# EAGLE design ESL_EMITTER (EAGLE 9.4.2)
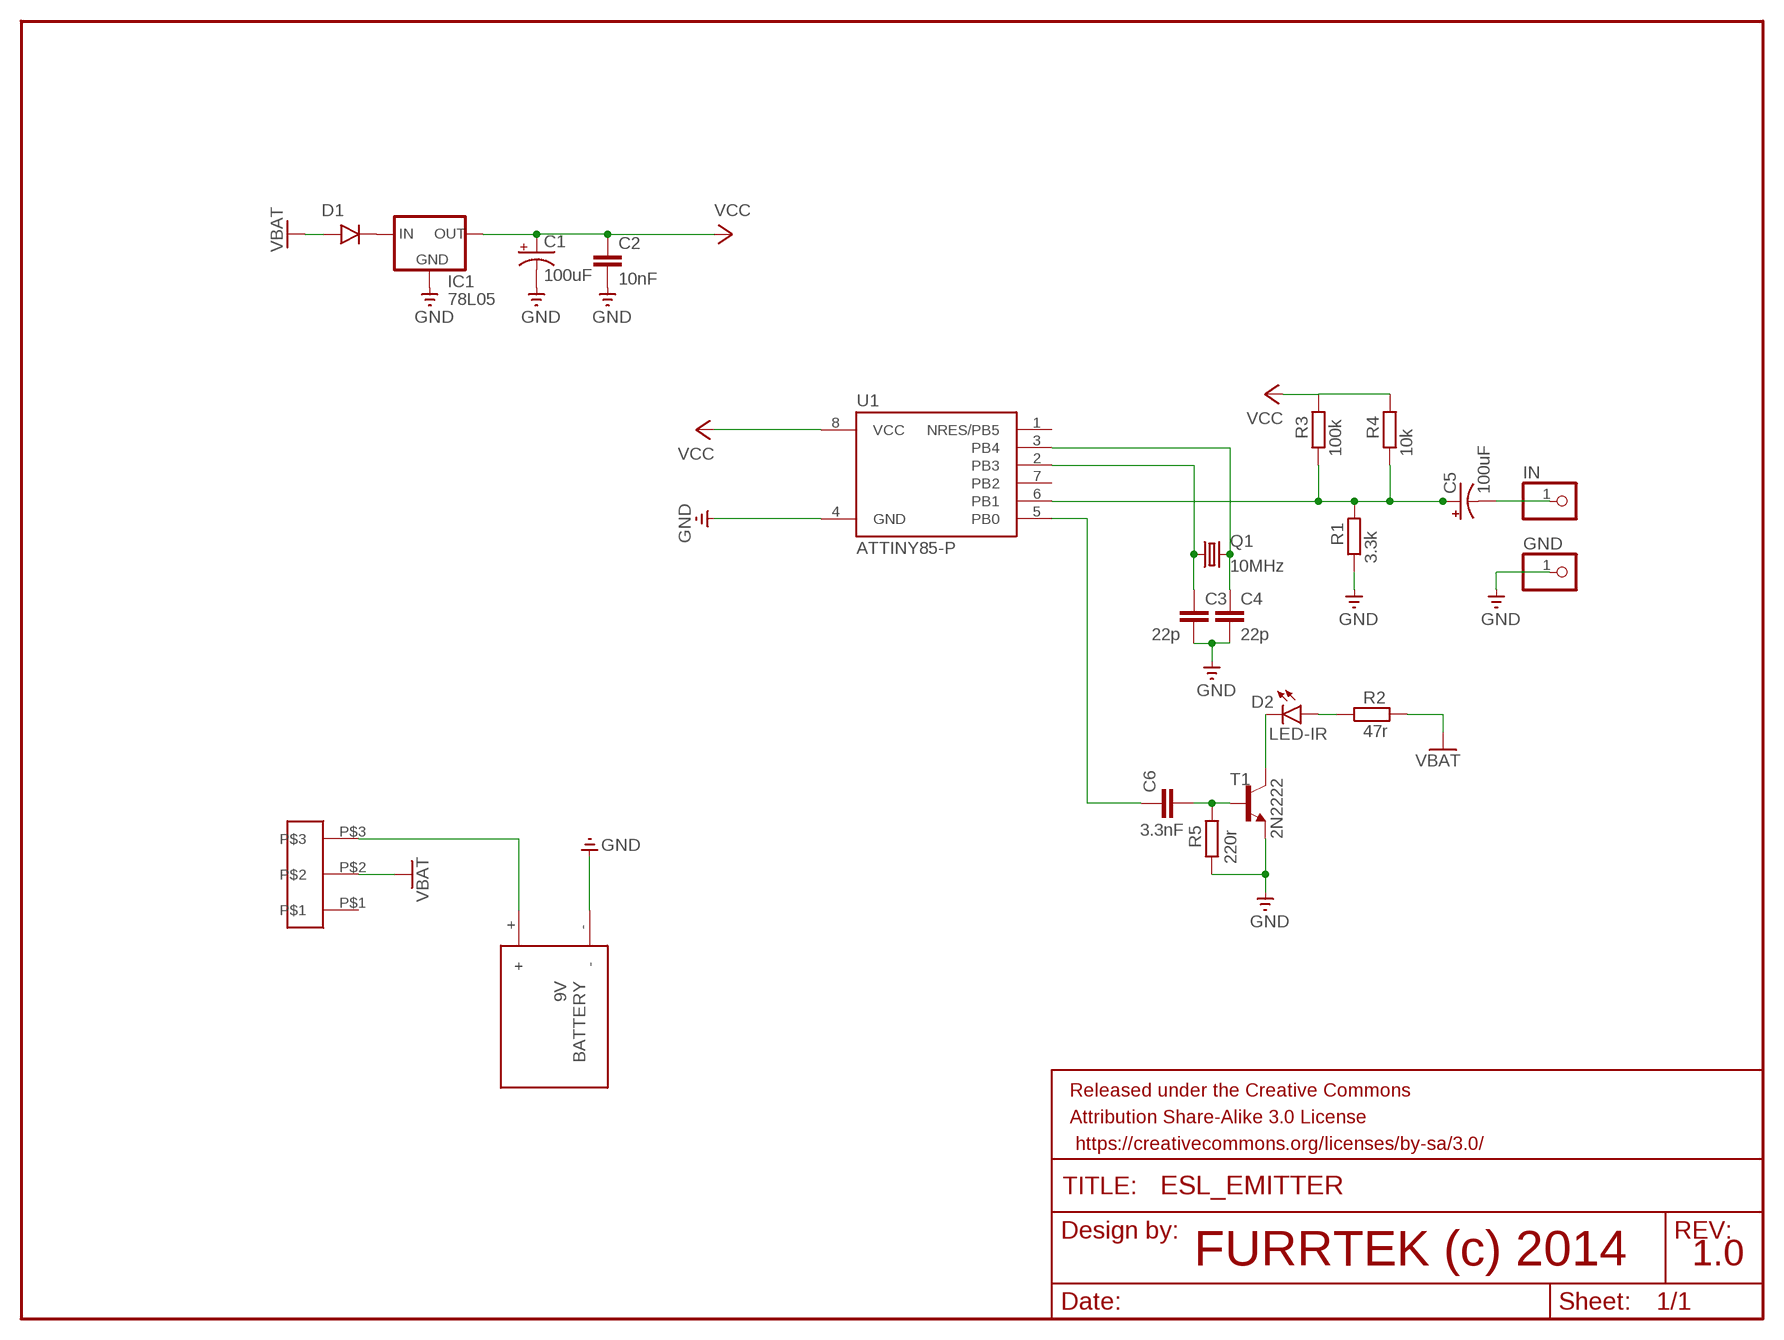
[diagram p0: schematic, sheet 1]

## Parts
C1  100uF  CAP_POLPTH2  [CPOL-RADIAL-10UF-25V]
C2  10nF  10NF-PTH-10MM-10000V-1-%  [CAP-PTH-10MM]
C3  22p  10NF-PTH-10MM-10000V-1-%  [CAP-PTH-10MM]
C4  22p  10NF-PTH-10MM-10000V-1-%  [CAP-PTH-10MM]
C5  100uF  CAP_POLPTH2  [CPOL-RADIAL-10UF-25V]
C6  3.3nF  10NF-PTH-10MM-10000V-1-%  [CAP-PTH-10MM]
D1  1N4001  [DO41-10]
D2  LED-IR  LED-3MM-NO_SILK  [LED_3MM-NS]
FRAME1  FRAME-LETTER  [CREATIVE_COMMONS]
GND  PINHD-1X1  [1X01]
IC1  78L05  V_REG_78XXSIDE  [78XXL]
IN  PINHD-1X1  [1X01]
Q1  10MHz  CRYSTALHC49U-H  [HC49U-H]
R1  3.3k  R-EU_0207/7  [0207/7]
R2  47r  R-EU_0207/7  [0207/7]
R3  100k  R-EU_0207/7  [0207/7]
R4  10k  R-EU_0207/7  [0207/7]
R5  220r  R-EU_0207/7  [0207/7]
T1  2N2222  [TO92-EBC-OVAL]
U1  ATTINY85-P  [PDIP08_300MIL]
U$2  PACKAGESWITCH  [SLIDESWITCH]
U$3  BAT  [BAT]

## Nets
GND: C1.2(-) C2.2 C3.2 C4.2 GND.1 IC1.GND R1.1 R5.1 T1.E U1.4(GND) U$3.-
N$1: D1.C(CATHODE) IC1.IN
N$2: C4.1 Q1.2 U1.3(PB4)
N$3: C3.1 Q1.1 U1.2(PB3)
N$4: C5.1(+) R1.2 R3.1 R4.1 U1.6(PB1)
N$5: C6.2 R5.2 T1.B
N$6: C6.1 U1.5(PB0)
N$7: D2.K(C) T1.C
N$8: C5.2(-) IN.1
N$12: U$2.P$3 U$3.+
N$16: D2.A R2.1
VBAT: D1.A(ANODE) R2.2 U$2.P$2
VCC: C1.1(+) C2.1 IC1.OUT R3.2 R4.2 U1.8(VCC)
Unconnected: U1.1(NRES/PB5) U1.7(PB2) U$2.P$1

## Notes on the sheet
- FURRTEK (c) 2014 | 1.0

## Library data of the parts
C1 C5 = SparkFun:CAP_POL: Capacitor Polarized These are standard SMD and PTH capacitors. Normally 10uF, 47uF, and 100uF in electrolytic and tantalum varieties. Always verify the external diameter of the through hole cap, it varies with capacity, voltage, and manufacturer. The EIA devices should be standard.
C2 = SparkFun-Capacitors:10NF: 0.01uF/10nF/10,000pF ceramic capacitors A capacitor is a passive two-terminal electrical component used to store electrical energy temporarily in an electric field. CAP-09321; PROD_ID: CAP-09321
C3 C4 C6 = SparkFun-Capacitors:10NF: 0.01uF/10nF/10,000pF ceramic capacitors A capacitor is a passive two-terminal electrical component used to store electrical energy temporarily in an electric field. CAP-09321; PROD_ID: CAP-09321; VALUE: 10nF
D1 = tango:1N4001: DIODE general purpose rectifier, 1 A
D2 = SparkFun-LED:LED: LED (Generic) Standard schematic elements and footprints for 5mm, 3mm, 1206, and 0603 sized LEDs. Generic LEDs with no color specified.
FRAME1 = SparkFun-Retired:FRAME-LETTER: Schematic Frame Standard 8.5x11 US Letter frame
GND IN = adafruit:PINHD-1X1: Pin header 1x1 for 0.1" spacing With round pins
IC1 = SparkFun:V_REG_78XX: Voltage Regulator Standard 7805 5V regulator. IGO (Input Ground Output). Spark Fun Electronics SKU : COM-00107
Q1 = adafruit:CRYSTAL: CRYSTAL; OC_FARNELL: 1666973; OC_NEWARK: unknown
R1-R5 = resistor:R-EU_: RESISTOR, European symbol
T1 = adafruit:2N2222: NPN TRANSISTOR Big oval pads
U1 = _hhn_attiny25_45_85:ATTINY85*: ATMEL ATtiny 85 Packages: P = PDIP 08 30mil S = SOIC 08 EIAJ 208mil Technologies Note: for complete ordering code (temp. range, finish, tape&reel etc.) see www.atmel.com • Supply Voltage: V = (1.8…5.5)V | [blank] = (2.7…5.5)V • Speed: 10 = 10 MHz | 20 = 20 MHz Author: Dipl.-Ing. FH Rainer Bayer HHN Hochschule Heilbronn (Heilbronn University), rainer.bayer@hs-heilbronn.de Ingenieurbüro ing-rb, mail@ing-rb.de
U$2 = SLIDESWITCH:PACKAGESWITCH
U$3 = battery:BAT: 2000mAh battery

## Board
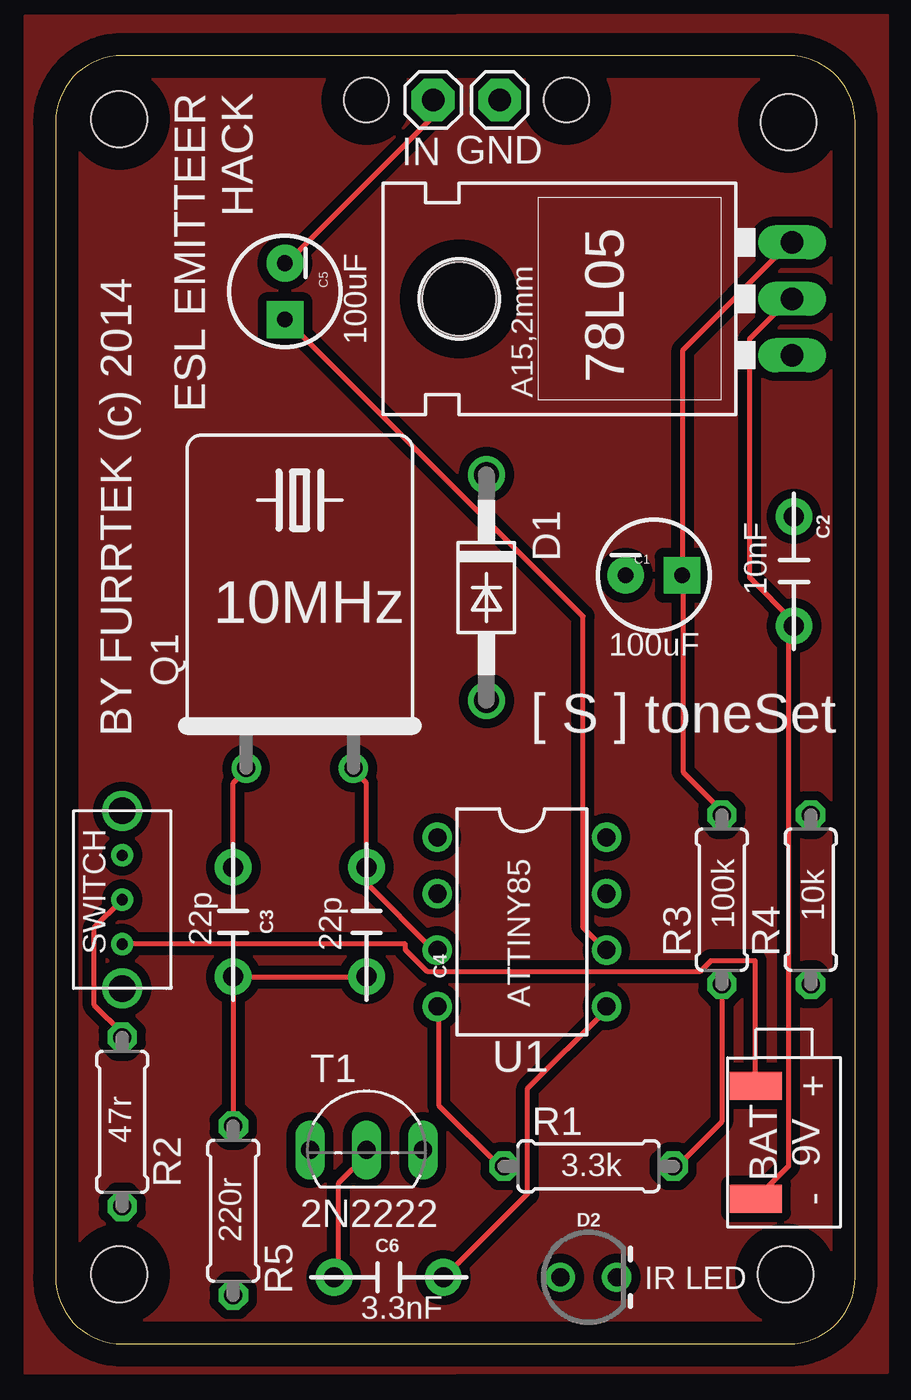
[diagram p1: board, top side]
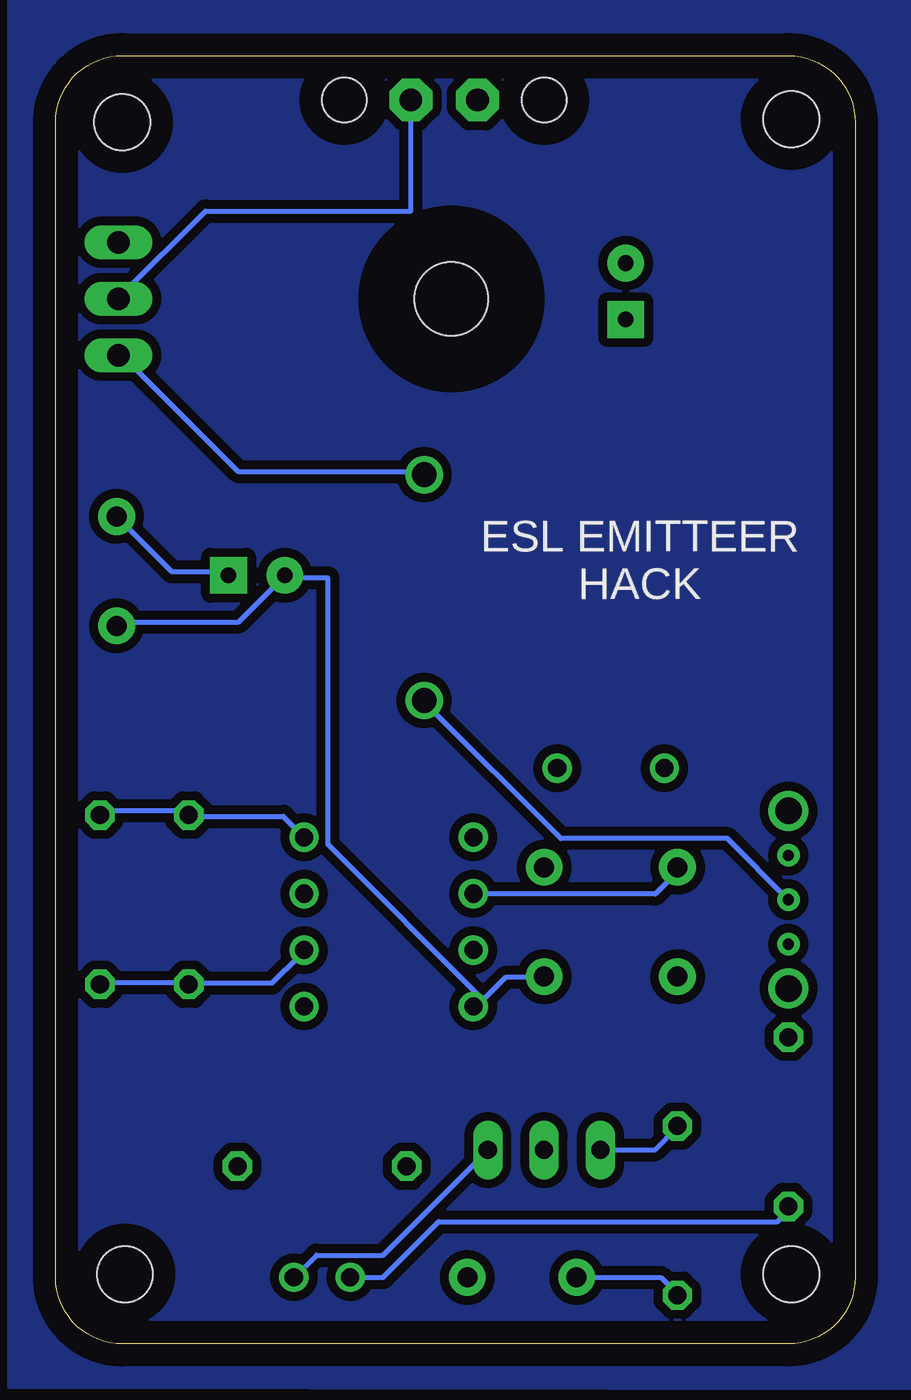
[diagram p2: board, bottom side, seen from below]

Size 36 x 58 mm. Coordinates in mm from the lower left corner, seen from the top.
Outline: 0,55 0,3 arc90 3,0 33,0 arc90 36,3 36,55 arc90 33,58 3,58 arc90 0,55
Copper layers (1*16): Top 0.035mm / dielectric 1.5mm / Bottom 0.035mm
Design rules "default *": minimum track width 9mil, minimum drill 0.35mm, track to track 0.4mm, track to pad 6mil, pad to pad 6mil, via to via 6mil, smd to smd 6mil, copper to edge 40mil, drill to drill 6mil, minimum pad ring 10mil, minimum via ring 8mil, stop-mask expansion 4mil, vias tented up to drill 0mil, thermal gap 10mil
Holes 2.5 mm at 2.87,55.13 33,55 2.87,3.13 32.87,3.13
Holes 2 mm at 14,56 23,56

### Footprints (pad centres in the part's own frame; a part is rotated, then mirrored left to right if it is on the bottom)
CPOL-RADIAL-10UF-25V = drill 0.7 pad 1.651 square: 1 1.27,0 | drill 0.7 pad 1.651: 2 -1.27,0
CAP-PTH-10MM = drill 0.9 pad 1.651: 1 -2.46,0; 2 2.46,0
DO41-10 = drill 1.118: A 5.08,0; C -5.08,0
LED_3MM-NS = drill 0.813: A -1.27,0; K 1.27,0
1X01 = drill 1.016 pad 1.93 octagon: 1 0,0
78XXL = drill 1.016 long: GND 0,-3.81; IN -2.54,-3.81; OUT 2.54,-3.81 | hole 3.302: 0,11.176
HC49U-H = drill 0.813: 1 -2.413,-5.08; 2 2.413,-5.08
0207/7 = drill 0.813 octagon: 1 -3.81,0; 2 3.81,0
TO92-EBC-OVAL = drill 0.813 long: B 0,-1.27; C 2.54,-1.27; E -2.54,-1.27
PDIP08_300MIL = drill 0.813: 1 -3.81,-3.81; 2 -1.27,-3.81; 3 1.27,-3.81; 4 3.81,-3.81; 5 3.81,3.81; 6 1.27,3.81; 7 -1.27,3.81; 8 -3.81,3.81
SLIDESWITCH = drill 0.5: P$1 0,0; P$2 0,-2; P$3 0,-4 | drill 1.2: P$4 0,2; P$5 0,-6
BAT = smd 1.27 x 2.337: + 7.62,-2.54; - 2.54,-2.54

### Placement (x,y rotation side)
C1  26.94,34.6 0 top
C2  33.25,34.79 270 top
C3  8,19 270 top
C4  14,19 270 top
C5  10.33,47.38 270 top
C6  15,3 180 top
D1  19.4,34.05 270 top
D2  24,3 0 top
FRAME1  -0.18,0.28 0 top
GND  20,56 0 top
IC1  29.35,47.05 90 top
IN  17,56 0 top
Q1  11,31 0 top
R1  24,8 0 top
R2  3,10 90 top
R3  30,20 90 top
R4  34,20 90 top
R5  8,6 270 top
T1  14,10 0 top
U1  21,19 270 top
U$2  3,22 0 top
U$3  29,4 90 top

### Tracks (layer width: path | path; a pad name or v marks a point on that pad's centre or on a via)
BOT
  pour Bottom: -2.46,-2.01 38.1,-1.96 38.1,61.13 -2.46,61.07
GND
  Top 0.229: R1.1 20,8 17.25,10.75 17.25,15 U1.4 | 8,16.5 14,16.5 C4.2 | 8,16.5 R5.1 | 8,16.5 C3.2 | U$3.- 33,8 33,32 33.25,32.25 C2.2 33.25,32.5 31.25,34.5 31.25,45.25 33,47 IC1.GND
  Bottom 0.229: R5.1 8,9.75 9,8.75 11.25,8.75 T1.E | 16.75,15.5 15.75,16.5 14,16.5 C4.2 | 16.75,15.5 17,15.25 U1.4 16.75,15.5 | C2.2 33.25,32.5 27.75,32.5 25.75,34.5 C1.2 25.5,34.5 23.75,34.5 23.75,22.5 16.75,15.5 | GND.1 20,51 29.25,51 33,47.25 IC1.GND
N$1
  Bottom 0.229: IC1.IN 33,44.5 27.75,39.25 19.5,39.25 D1.C
N$2
  Top 0.229: U1.3 17,17.75 14,20.75 C4.1 14,25.25 13.5,25.75 Q1.2
N$3
  Top 0.229: C3.1 8,25.25 8.5,25.75 Q1.1
  Bottom 0.229: U1.2 17,20.25 9,20.25 8,21.25 C3.1
N$4
  Top 0.229: R3.1 30,10 28,8 R1.2 | C5.1 10.5,46 23.75,32.75 23.75,18.75 24.75,17.75 U1.6
  Bottom 0.229: 30,16.25 34,16.25 R4.1 | 30,16.25 26.25,16.25 25,17.5 U1.6 | 30,16.25 R3.1
N$5
  Top 0.229: T1.B 14,8.5 12.75,7.25 12.75,3 C6.2
  Bottom 0.229: C6.2 8.75,3 8,2.25 R5.2
N$6
  Top 0.229: U1.5 24.75,15 21.25,11.5 21.25,6.75 17.5,3 C6.1
N$7
  Bottom 0.229: T1.C 16.75,8.5 21.25,4 24.25,4 25.25,3 D2.K
N$8
  Top 0.229: IN.1 17,55.25 10.5,48.75 C5.2
N$12
  Top 0.229: U$2.P$3 15.75,18 15.75,17.75 16.75,16.75 29,16.75 29.5,17.25 31.5,17.25 31.5,11.75 U$3.+
N$16
  Bottom 0.229: D2.A 21.25,3 18.75,5.5 3.5,5.5 3,6 R2.1
TOP
  pour Top: -1.36,-1.33 37.45,-1.28 37.45,59.82 -1.36,59.77
VBAT
  Top 0.229: U$2.P$2 1.75,18.75 1.75,15.25 3,14 R2.2
  Bottom 0.229: U$2.P$2 5.75,22.75 13.25,22.75 19.25,28.75 D1.A
VCC
  Top 0.229: IC1.OUT 33,49.5 28.25,44.75 28.25,34.75 C1.1 28.25,34.5 28.25,25.75 30,24 R3.2
  Bottom 0.229: U1.8 25.75,23.75 30,23.75 R3.2 30,24 34,24 R4.2 | C2.1 30.75,34.75 28.25,34.75 C1.1

### Text on the board
tPlace: ESL EMITTEER / HACK | 78L05 | BY FURRTEK (c) 2014 | [ S ] toneSet | SWITCH | 2N2222
bPlace: ESL EMITTEER / HACK
tNames: 100uF | 10nF | 10MHz | 100uF | 100k | 10k | 22p | 22p | ATTINY85 | 47r | 3.3k | 220r | IR LED | 3.3nF